# EAGLE board QCopter (EAGLE 7.1.0), part 1 of 2
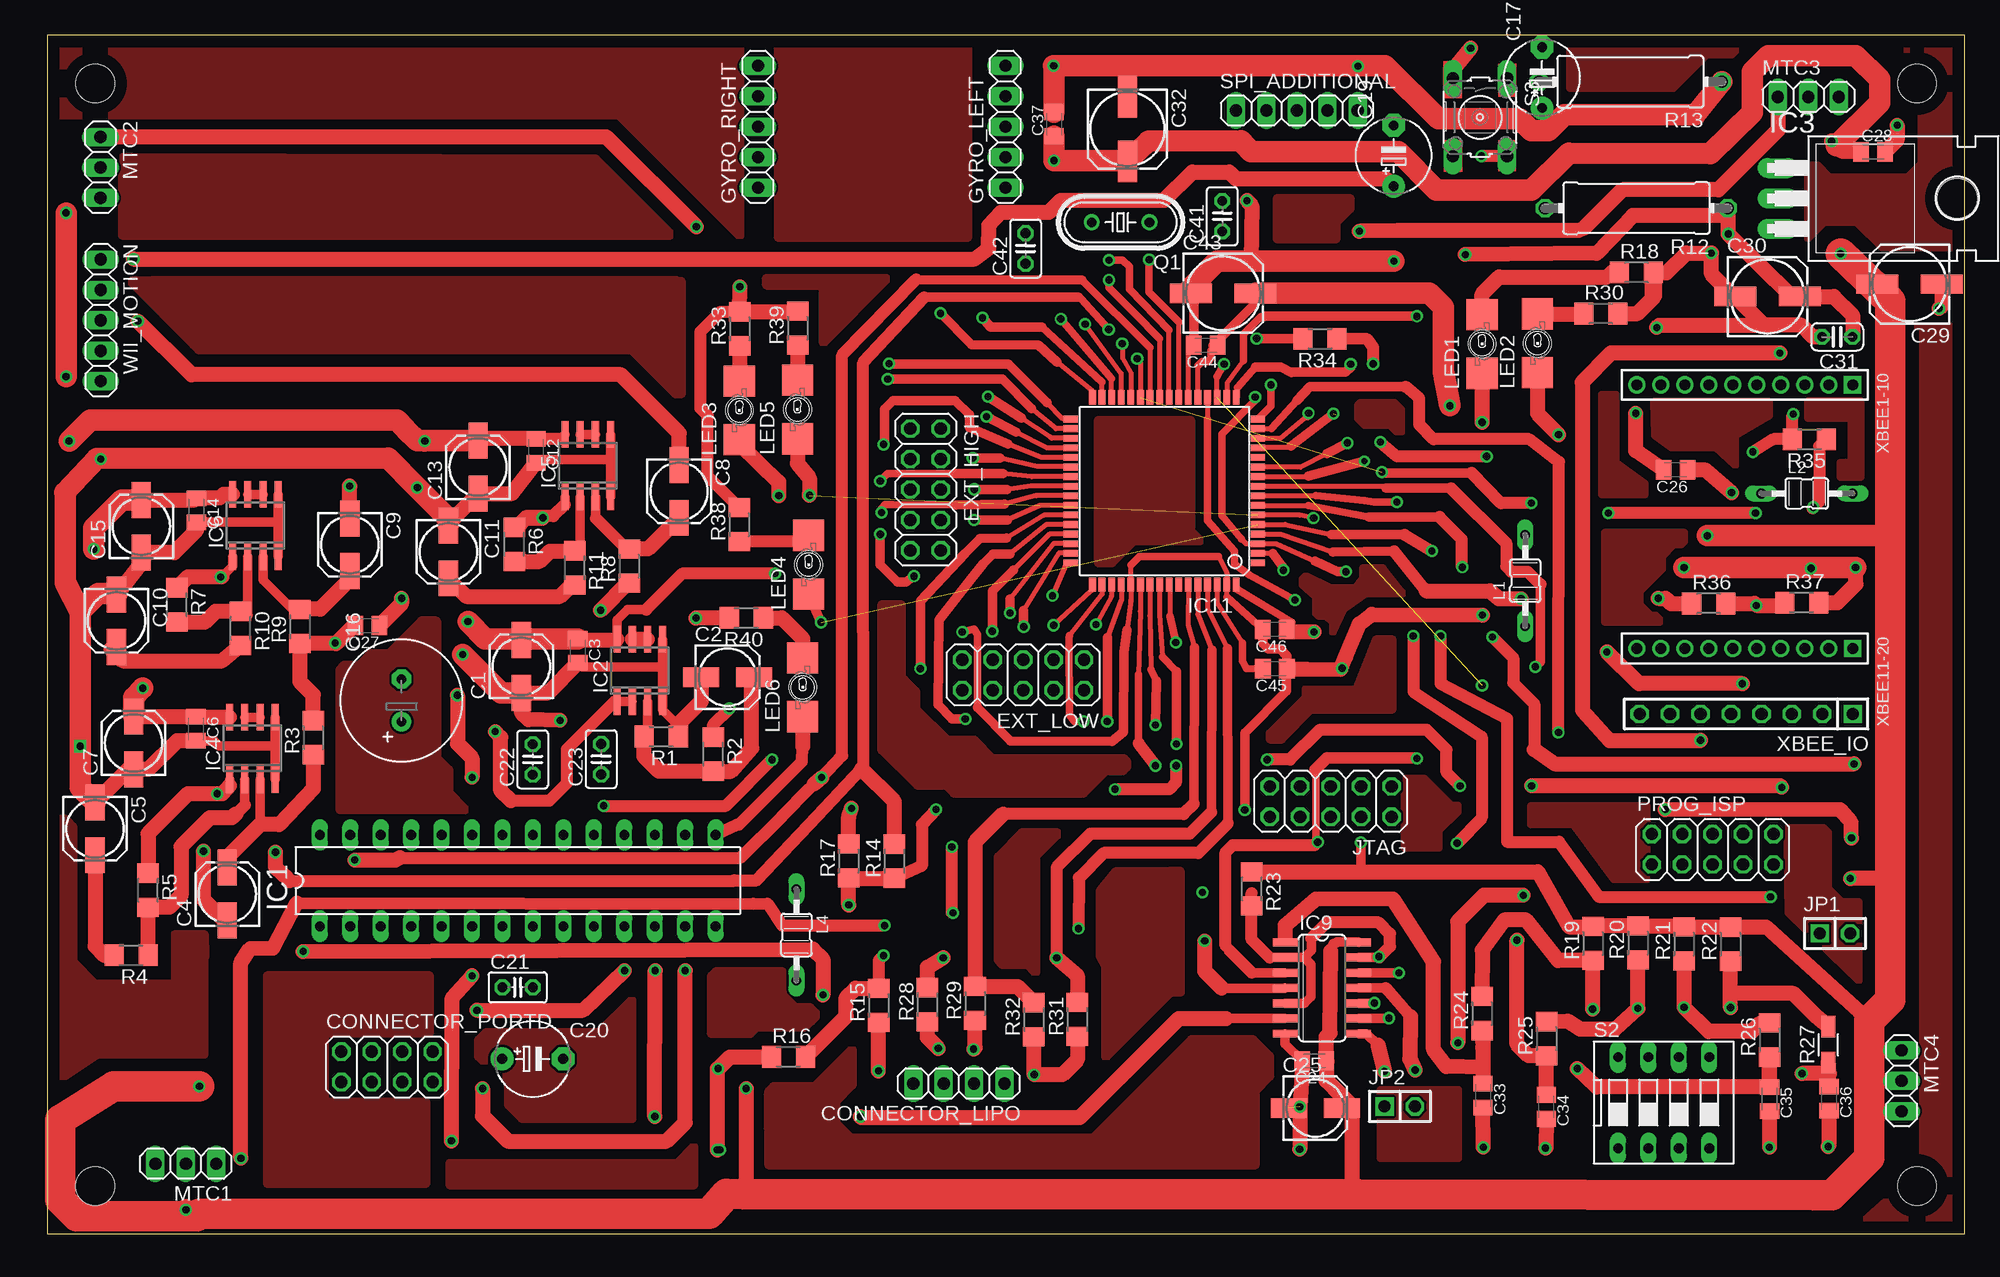
[diagram p1: board, top side]
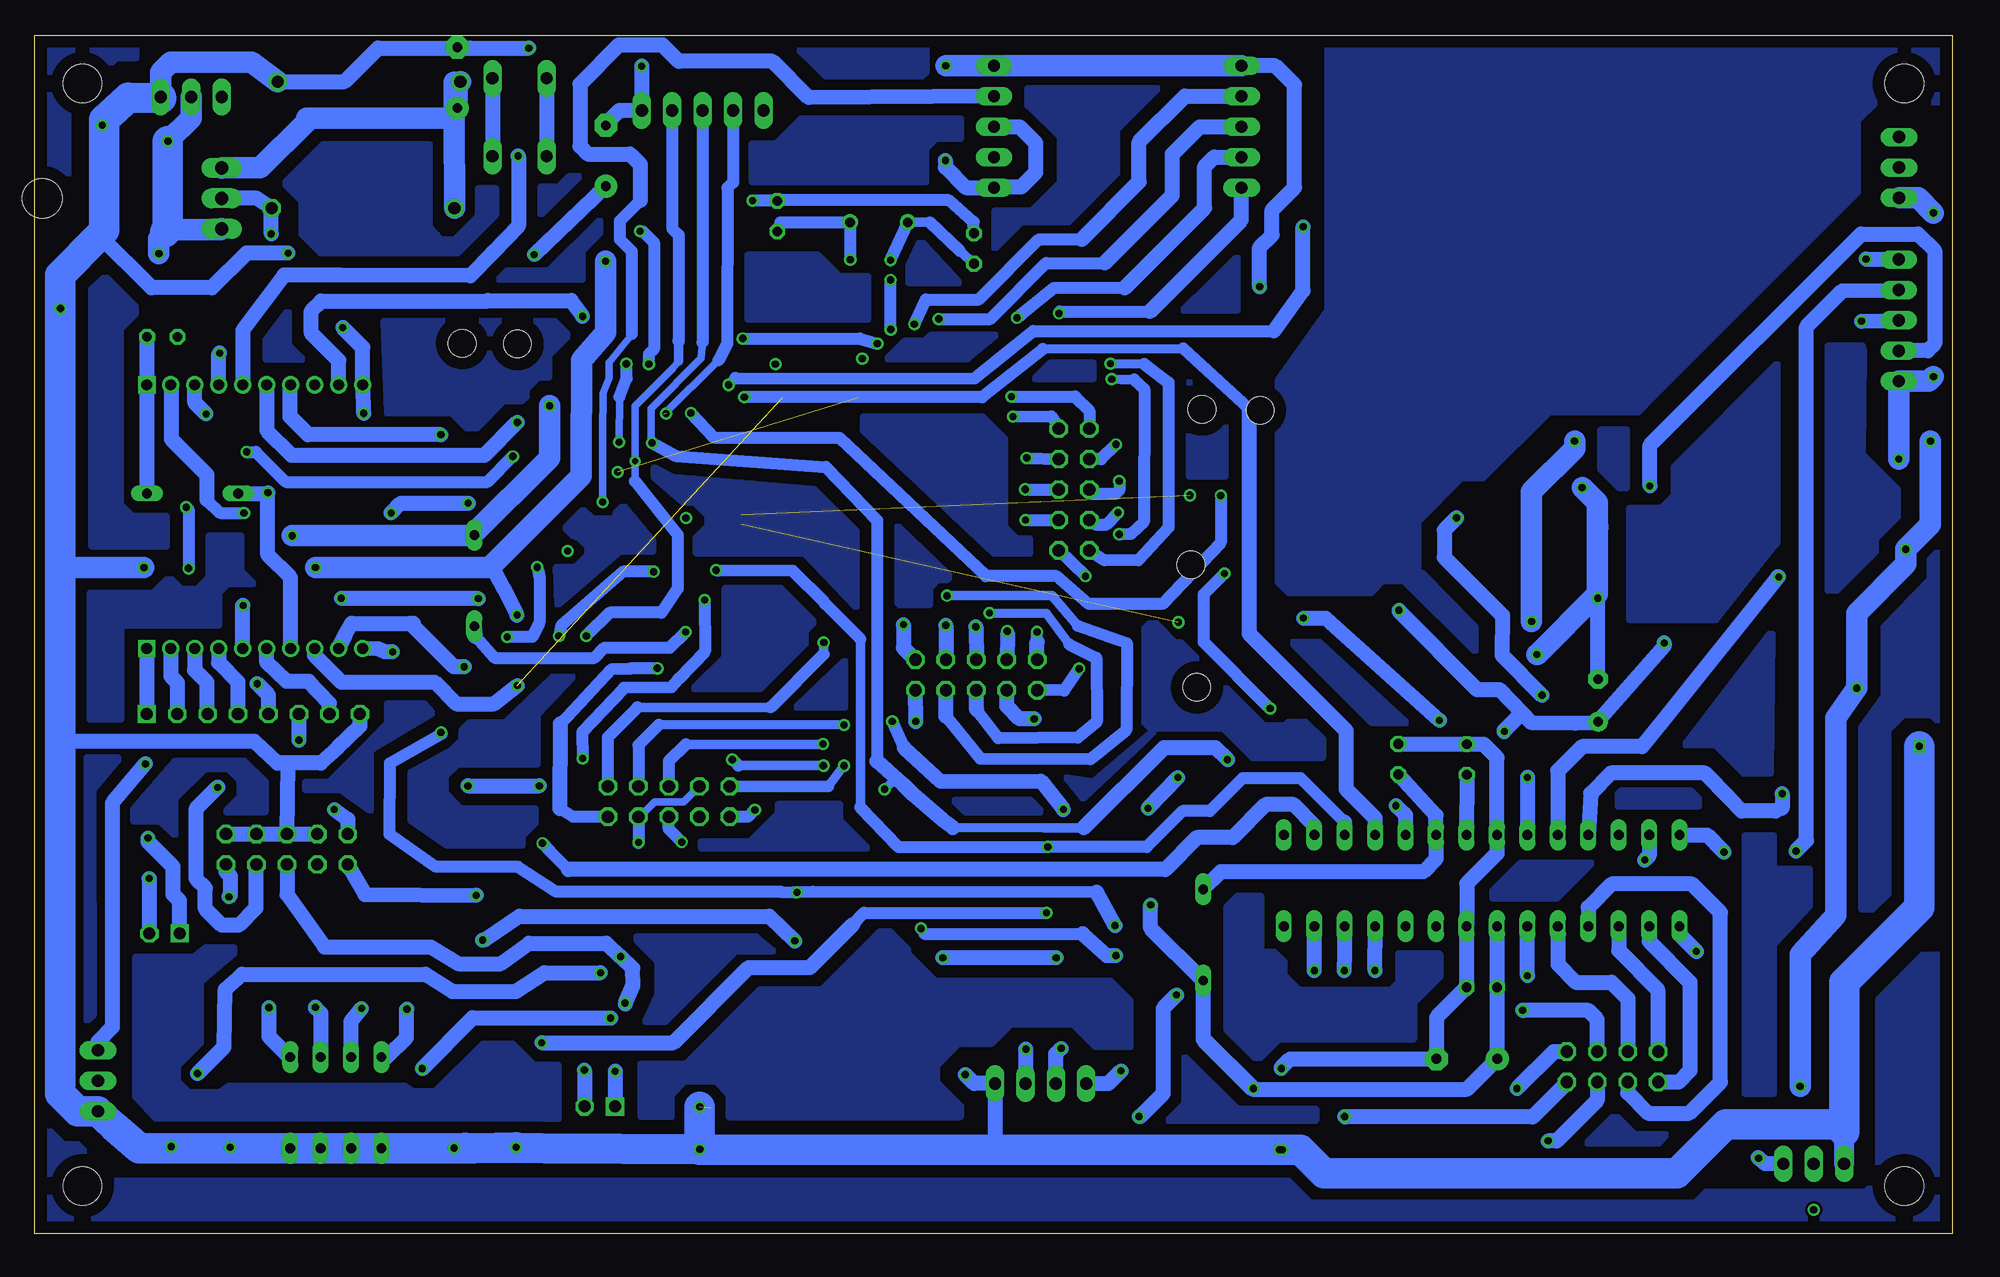
[diagram p2: board, bottom side, seen from below]

Size 160 x 100 mm. Coordinates in mm from the lower left corner, seen from the top.
Outline: 0,0 160,0 160,100 0,100 0,0
Copper layers (1*16): Top 0.035mm / dielectric 1.5mm / Bottom 0.035mm
Design rules "default": minimum track width 10mil, minimum drill 24mil, track to track 8mil, track to pad 8mil, pad to pad 8mil, via to via 8mil, smd to smd 8mil, copper to edge 40mil, drill to drill 8mil, minimum pad ring 10mil, minimum via ring 8mil, stop-mask expansion 4mil, vias tented up to drill 0mil, thermal gap 10mil
Holes 3.2 mm at 4,4 156,4 156,96 4,96

## Footprints (pad centres in the part's own frame; a part is rotated, then mirrored left to right if it is on the bottom)
153CLV-0505 = smd 3 x 1.6: + 2.2,0; - -2.2,0
C0805K = smd 1.3 x 1.6: 1 -1,0; 2 1,0
E3,5-10 = drill 0.813 pad 1.6: + -1.778,0 | drill 0.813 pad 1.6 octagon: - 1.778,0
E5-6 = drill 0.813 pad 1.905: + -2.54,0 | drill 0.813 pad 1.905 octagon: - 2.54,0
C025-025X050 = drill 0.813 octagon: 1 -1.27,0; 2 1.27,0
153CLV-0605 = smd 3.5 x 1.6: + 2.7,0; - -2.7,0
C025-024X044 = drill 0.813 octagon: 1 -1.27,0; 2 1.27,0
1X04 = drill 1.016 long: 1 -3.81,0; 2 -1.27,0; 3 1.27,0; 4 3.81,0
2X04 = drill 1.016 octagon: 1 -3.81,-1.27; 2 -3.81,1.27; 3 -1.27,-1.27; 4 -1.27,1.27; 5 1.27,-1.27; 6 1.27,1.27; 7 3.81,-1.27; 8 3.81,1.27
2X05 = drill 1.016 octagon: 1 -5.08,-1.27; 2 -5.08,1.27; 3 -2.54,-1.27; 4 -2.54,1.27; 5 0,-1.27; 6 0,1.27; 7 2.54,-1.27; 8 2.54,1.27; 9 5.08,-1.27; 10 5.08,1.27
1X05 = drill 1.016 long: 1 -5.08,0; 2 -2.54,0; 3 0,0; 4 2.54,0; 5 5.08,0
DIL28-3 = drill 0.813 long: 1 -16.51,-3.81; 2 -13.97,-3.81; 3 -11.43,-3.81; 4 -8.89,-3.81; 5 -6.35,-3.81; 6 -3.81,-3.81; 7 -1.27,-3.81; 8 1.27,-3.81; 9 3.81,-3.81; 10 6.35,-3.81; 11 8.89,-3.81; 12 11.43,-3.81; 13 13.97,-3.81; 14 16.51,-3.81; 15 16.51,3.81; 16 13.97,3.81; 17 11.43,3.81; 18 8.89,3.81; 19 6.35,3.81; 20 3.81,3.81; 21 1.27,3.81; 22 -1.27,3.81; 23 -3.81,3.81; 24 -6.35,3.81; 25 -8.89,3.81; 26 -11.43,3.81; 27 -13.97,3.81; 28 -16.51,3.81
SO08 = smd 0.6 x 2.2: 1 -1.905,-2.6; 2 -0.635,-2.6; 3 0.635,-2.6; 4 1.905,-2.6; 5 1.905,2.6; 6 0.635,2.6; 7 -0.635,2.6; 8 -1.905,2.6
TO220H = drill 1.118 long: 1 -2.54,-10.16; 2 0,-10.16; 3 2.54,-10.16 | hole 3.302: 0,4.826
SO14 = smd 0.66 x 2.032: 1 -3.81,-3.073; 2 -2.54,-3.073; 3 -1.27,-3.073; 4 0,-3.073; 5 1.27,-3.073; 6 2.54,-3.073; 7 3.81,-3.073; 8 3.81,3.073; 9 2.54,3.073; 10 1.27,3.073; 11 0,3.073; 12 -1.27,3.073; 13 -2.54,3.073; 14 -3.81,3.073
TQFP64 = smd 1.194 x 0.559: 1 -7.8,6; 2 -7.8,5.2; 3 -7.8,4.4; 4 -7.8,3.6; 5 -7.8,2.8; 6 -7.8,2; 7 -7.8,1.2; 8 -7.8,0.4; 9 -7.8,-0.4; 10 -7.8,-1.2; 11 -7.8,-2; 12 -7.8,-2.8; 13 -7.8,-3.6; 14 -7.8,-4.4; 15 -7.8,-5.2; 16 -7.8,-6; 33 7.8,-6; 34 7.8,-5.2; 35 7.8,-4.4; 36 7.8,-3.6; 37 7.8,-2.8; 38 7.8,-2; 39 7.8,-1.2; 40 7.8,-0.4; 41 7.8,0.4; 42 7.8,1.2; 43 7.8,2; 44 7.8,2.8; 45 7.8,3.6; 46 7.8,4.4; 47 7.8,5.2; 48 7.8,6 | smd 0.559 x 1.194: 17 -6,-7.8; 18 -5.2,-7.8; 19 -4.4,-7.8; 20 -3.6,-7.8; 21 -2.8,-7.8; 22 -2,-7.8; 23 -1.2,-7.8; 24 -0.4,-7.8; 25 0.4,-7.8; 26 1.2,-7.8; 27 2,-7.8; 28 2.8,-7.8; 29 3.6,-7.8; 30 4.4,-7.8; 31 5.2,-7.8; 32 6,-7.8; 49 6,7.8; 50 5.2,7.8; 51 4.4,7.8; 52 3.6,7.8; 53 2.8,7.8; 54 2,7.8; 55 1.2,7.8; 56 0.4,7.8; 57 -0.4,7.8; 58 -1.2,7.8; 59 -2,7.8; 60 -2.8,7.8; 61 -3.6,7.8; 62 -4.4,7.8; 63 -5.2,7.8; 64 -6,7.8
1X02 = drill 1.016 square: 1 -1.27,0 | drill 1.016 octagon: 2 1.27,0
MMICC7 = drill 0.813 long: 1 -3.81,0; 2 3.81,0
P47F-TOP = smd 2.6 x 2.6: A -2.45,0; C 2.45,0 | hole 2.3: 0,0
1X03 = drill 1.016 long: 1 -2.54,0; 2 0,0; 3 2.54,0
HC49/S = drill 0.813: 1 -2.413,0; 2 2.413,0
R1206 = smd 1.6 x 1.803: 1 -1.422,0; 2 1.422,0
0414/15 = drill 1.016 octagon: 1 -7.62,0; 2 7.62,0
R1206W = smd 1.8 x 1.2: 1 -1.499,0; 2 1.499,0
DS-04 = drill 0.813 long: 1 -3.81,-3.81; 2 -1.27,-3.81; 3 1.27,-3.81; 4 3.81,-3.81; 5 3.81,3.81; 6 1.27,3.81; 7 -1.27,3.81; 8 -3.81,3.81
B3F-10XX = drill 1.016 long: 1 -3.251,2.261; 2 3.251,2.261; 3 -3.251,-2.261; 4 3.251,-2.261
1X10M = drill 0.914 square: 1 -9,0 | drill 0.914: 2 -7,0; 3 -5,0; 4 -3,0; 5 -1,0; 6 1,0; 7 3,0; 8 5,0; 9 7,0; 10 9,0
1X08 = drill 1.016 square: 1 -8.89,0 | drill 1.016 octagon: 2 -6.35,0; 3 -3.81,0; 4 -1.27,0; 5 1.27,0; 6 3.81,0; 7 6.35,0; 8 8.89,0

## Placement (x,y rotation side)
C1  100u  [153CLV-0505]  39.55,47.35 90 top
C2  10u  [153CLV-0505]  56.76,46.45 0 top
C3  100n  [C0805K]  44.27,48.64 270 top
C4  10u  [153CLV-0505]  15.02,28.36 90 top
C5  100u  [153CLV-0505]  3.98,33.8 270 top
C6  100n  [C0805K]  12.41,42.13 270 top
C7  22u  [153CLV-0505]  7.21,40.96 90 top
C8  10u  [153CLV-0505]  52.71,61.95 270 top
C9  10u  [153CLV-0505]  25.25,57.51 270 top
C10  100u  [153CLV-0505]  5.78,51.16 270 top
C11  100u  [153CLV-0505]  33.46,56.9 270 top
C12  100n  [C0805K]  40.78,65.34 270 top
C13  22u  [153CLV-0505]  35.94,63.98 90 top
C14  100n  [C0805K]  12.44,60.39 270 top
C15  22u  [153CLV-0505]  7.85,59.05 90 top
C16  1000u  [E3,5-10]  29.55,44.51 90 top
C17  10u  [E5-6]  124.72,96.48 90 top
C19  1u  [E5-6]  112.34,89.96 90 top
C20  100u  [E5-6]  40.5,14.6 0 top
C21  100n  [C025-025X050]  39.24,20.57 0 top
C22  100n  [C025-025X050]  40.5,39.58 90 top
C23  100n  [C025-025X050]  46.22,39.61 90 top
C24  100n  [C0805K]  105.72,14.43 180 top
C25  10u  [153CLV-0505]  105.8,10.49 0 top
C26  100n  [C0805K]  135.86,63.75 180 top
C27  100n  [C0805K]  26.72,50.75 180 top
C28  100n  [C0805K]  152.34,90.28 0 top
C29  100u  [153CLV-0605]  155.38,79.25 180 top
C30  1u  [153CLV-0605]  143.53,78.22 0 top
C31  8.2p  [C025-024X044]  149.34,74.84 180 top
C32  1u  [153CLV-0605]  90.12,92.19 270 top
C33  10n  [C0805K]  119.78,11.54 270 top
C34  10n  [C0805K]  125.07,10.6 270 top
C35  10n  [C0805K]  143.69,11.25 270 top
C36  10n  [C0805K]  148.66,11.28 270 top
C37  100n  [C0805K]  84,92.59 90 top
C41  22p  [C025-025X050]  98.03,84.92 90 top
C42  22p  [C025-025X050]  81.63,82.22 90 top
C43  100u  [153CLV-0605]  98.11,78.48 0 top
C44  100n  [C0805K]  96.66,74.15 180 top
C45  100n  [C0805K]  102.43,47.15 180 top
C46  100n  [C0805K]  102.41,50.43 180 top
CONNECTOR_LIPO  [1X04]  76.06,12.54 180 top
CONNECTOR_PORTD  [2X04]  28.34,13.93 0 top
EXT_HIGH  [2X05]  73.28,62.11 270 top
EXT_LOW  [2X05]  81.42,46.63 180 top
GYRO_LEFT  [1X05]  79.95,92.38 90 top
GYRO_RIGHT  [1X05]  59.29,92.38 90 top
IC1  MEGA8-P  [DIL28-3]  39.25,29.47 0 top
IC2  LM358D  [SO08]  49.44,47.01 0 top
IC3  317T  [TO220H]  154.54,86.4 270 top
IC4  LM358D  [SO08]  17.11,40.51 0 top
IC5  LM358D  [SO08]  45.1,64.1 0 top
IC6  LM358D  [SO08]  17.37,59.1 0 top
IC9  74LS32D  [SO14]  106.35,20.52 270 top
IC11  MEGA64-A  [TQFP64]  93.2,61.99 180 top
JP1  [1X02]  149.15,25.06 0 top
JP2  [1X02]  112.84,10.62 0 top
JTAG  [2X05]  107.08,36.07 180 top
L1  MMICC7  [MMICC7]  123.31,54.5 90 top
L2  MMICC7  [MMICC7]  146.81,61.78 0 top
L4  MMICC7  [MMICC7]  62.5,24.94 270 top
LED1  LAP4-TOP  [P47F-TOP]  119.71,74.25 90 top
LED2  LAP4-TOP  [P47F-TOP]  124.33,74.31 90 top
LED3  LAP4-TOP  [P47F-TOP]  57.74,68.72 90 top
LED4  LAP4-TOP  [P47F-TOP]  63.52,55.84 90 top
LED5  LAP4-TOP  [P47F-TOP]  62.59,68.79 90 top
LED6  LAP4-TOP  [P47F-TOP]  63.03,45.6 90 top
MTC1  [1X03]  11.56,5.85 180 top
MTC2  [1X03]  4.43,88.98 270 top
MTC3  [1X03]  146.94,94.87 0 top
MTC4  [1X03]  154.72,12.76 270 top
PROG_ISP  [2X05]  138.95,32.09 0 top
Q1  8MHz  [HC49/S]  89.55,84.41 180 top
R1  10k  [R1206]  51.22,41.5 180 top
R2  10k  [R1206]  55.56,40.02 270 top
R3  22k  [R1206]  22.19,41.4 90 top
R4  2k  [R1206]  6.99,23.25 180 top
R5  50k  [R1206]  8.4,28.67 270 top
R6  50k  [R1206]  38.97,57.53 270 top
R7  50k  [R1206]  10.81,52.48 270 top
R8  22k  [R1206]  48.56,55.73 90 top
R9  22k  [R1206]  21.09,50.68 90 top
R10  2k  [R1206]  16.13,50.52 270 top
R11  2k  [R1206]  44.01,55.57 270 top
R12  470  [0414/15]  132.59,85.58 180 top
R13  1240  [0414/15]  132.09,96.15 180 top
R14  10k  [R1206]  70.68,31.1 90 top
R15  20k  [R1206]  69.36,19.06 90 top
R16  10k  [R1206]  61.85,14.77 0 top
R17  10k  [R1206]  66.87,31.11 90 top
R18  470  [R1206]  132.59,80.22 0 top
R19  20k  [R1206]  128.96,24.23 90 top
R20  20k  [R1206]  132.71,24.28 90 top
R21  20k  [R1206]  136.56,24.2 90 top
R22  20k  [R1206]  140.43,24.17 90 top
R23  10k  [R1206]  100.5,28.79 270 top
R24  20k  [R1206]  119.71,18.38 90 top
R25  20k  [R1206]  125.09,16.28 90 top
R26  20k  [R1206]  143.68,16.18 90 top
R27  20k  [R1206W]  148.59,15.79 90 top
R28  20k  [R1206]  73.44,19.12 90 top
R29  20k  [R1206]  77.41,19.22 90 top
R30  470  [R1206]  129.63,76.79 0 top
R31  10k  [R1206]  85.94,17.89 90 top
R32  10k  [R1206]  82.31,17.87 90 top
R33  1k  [R1206]  57.78,75.52 90 top
R34  10k  [R1206]  106.19,74.68 180 top
R35  20k  [R1206]  147.02,66.31 180 top
R36  10k  [R1206]  138.62,52.6 0 top
R37  20k  [R1206]  146.38,52.67 0 top
R38  1k  [R1206]  57.74,59.18 90 top
R39  1k  [R1206]  62.61,75.57 90 top
R40  1k  [R1206]  58.32,51.4 180 top
S2  [DS-04]  134.86,10.94 0 top
S3  [B3F-10XX]  119.54,93.17 270 top
SPI_ADDITIONAL  [1X05]  104.26,93.74 0 top
WII_MOTION  [1X05]  4.47,76.23 270 top
XBEE1-10  [1X10M]  141.62,70.84 180 top
XBEE11-20  [1X10M]  141.64,48.84 180 top
XBEE_IO  [1X08]  141.75,43.38 180 top

## Tracks (layer width: path | path; a pad name or v marks a point on that pad's centre or on a via)
ADC1  (via drill 0.6)
  Top 0.813: IC5.1 43.2,60.85 | 39.89,59.88 R6.1
  Top 1.016: 43.2,60.85 42.22,59.88 39.89,59.88
  Top 1.27: R6.1 39.2,58.95 39.97,59.72 41.31,59.72 v41.34,59.75 | v34.22,44.94 34.22,40.91 35.44,39.69 v35.44,38.09
  Bottom 1.27: v41.34,59.75 42.38,58.72 42.38,56.44 37.56,51.62 37.53,51.62 37.56,48.28 v34.22,44.94 | v35.44,38.09 IC1.23
ADC2  (via drill 0.6)
  Top 0.813: IC6.1 15.46,55.71 14.56,54.81
  Top 1.27: R7.1 11.72,54.81 v14.47,54.81 14.56,54.81
  Bottom 1.27: v14.47,54.81 14.56,54.81 24.09,42.88 25.88,40.66 30.88,40.66 32.91,38.62 IC1.24
ADC3  (via drill 0.6)
  Top 0.813: IC4.1 15.21,37.4 14.53,36.72
  Top 1.27: 14.53,36.72 11.72,36.72 8.41,33.41 R5.1 | 15.21,37.4 14.59,36.72 v14.19,36.72
  Bottom 1.27: v14.19,36.72 14.19,35.53 14.72,35.28 17.56,35.28 18.56,36.34 20.62,38.44 28.5,38.44 30.16,36.75 IC1.25
BMA_INT  (via drill 0.6)
  Top 0.406: IC11.8 105.84,61.59
  Top 0.61: 105.84,61.59 109.88,61.19 110.69,61.06 v112.59,61.06
  Bottom 0.61: v112.59,61.06 112.59,66.78 112.56,70.16 112.06,71.41 112.06,72.72 110.16,75.09
  Bottom 1.016: 110.16,75.09 110.16,81.97 111.16,82.97 111.16,84.53 109.47,86.22
  Bottom 1.27: GYRO_LEFT.4 95.38,94.81 95.41,94.81 98.44,97.84 106.25,97.84 107.59,99.19 111.25,99.19 114.5,95.94 114.5,90.75 113.84,90.09 110.31,90.09 109.47,89.25 109.47,86.22
BMA_MISO  (via drill 0.6)
  Top 0.406: IC11.29 89.6,71.77 89.59,71.78 v86.59,75.91
  Bottom 1.016: v86.59,75.91 85.62,77.97 81.22,77.97 76.19,83 72.62,83 | 59.31,94.94 GYRO_RIGHT.4
  Bottom 1.27: 72.62,83 67.84,87.78 67.84,91.12 64.03,94.94 59.31,94.94
BMA_MOSI  (via drill 0.6)
  Top 0.406: IC11.30 88.8,71.38
  Top 0.61: 88.8,71.38 v84.56,76.34
  Bottom 1.016: v84.56,76.34 80.25,76.34 75.59,81 70.72,81 | GYRO_RIGHT.3
  Bottom 1.27: 70.72,81 65.06,86.66 65.06,90.09 62.78,92.38 GYRO_RIGHT.3
BMA_SCK  (via drill 0.6)
  Top 0.406: IC11.31 88,71.06
  Top 0.61: 88,71.06 83,75.66
  Top 0.813: 83,75.66 78.69,75.66 v78.03,76.44
  Bottom 1.016: 69.03,78.94 74.91,78.94 77.72,76.66 v78.03,76.44 | GYRO_RIGHT.2
  Bottom 1.27: 69.03,78.94 62.38,85.59 62.38,89.06 61.59,89.84 GYRO_RIGHT.2
BMA_SS  (via drill 0.6)
  Top 0.406: IC11.32 87.19,70.31 84.25,72.75
  Top 0.813: 84.25,72.75 82.69,74.16 77.09,74.19 v74.53,76.81
  Bottom 0.813: v74.53,76.81 74.47,76.97
  Bottom 1.016: 74.47,76.97 66.94,76.97 | 59.31,87.28 GYRO_RIGHT.1
  Bottom 1.27: 66.94,76.97 59.31,84.59 59.31,87.28
EXT_LOW  (via drill 0.6)
  Top 0.406: IC11.51 88.78,53.19 v87.5,50.84
  Bottom 1.27: v87.5,50.84 87.5,48.9 EXT_LOW.1
EXTMEM_LATCH_EN  (via drill 0.6)
  Top 0.406: IC11.43 83.16,59.97 80.03,58.06
  Top 0.813: 80.03,58.06 77.81,58.03 76.56,56.78 72.84,52.81 v72.84,47.16
  Bottom 1.016: v72.84,47.16 74.11,45.33 EXT_LOW.10
EXTMEM_RD  (via drill 0.6)
  Top 0.406: IC11.34 84.16,67.19 82.12,68.88
  Top 0.813: 82.12,68.88 79.69,71.31 v70.12,71.31 | v69.5,58.38 69.5,55.84 70.94,54.41 71.66,54.41 v72.31,54.88
  Bottom 0.813: v70.12,71.31 69.31,71.28 68.25,71.28 | 69.47,58.34 v69.5,58.38 | 74.53,57.02 EXT_HIGH.10
  Bottom 1.016: 68.25,71.28 67.41,70.5 67.44,59.41 68.5,58.41 69.47,58.34 | v72.31,54.88 74.53,57.02
EXTMEM_WR  (via drill 0.6)
  Top 0.406: IC11.33 84.76,67.99 83.41,69.34
  Top 0.813: 83.41,69.34 83.41,69.38 80.19,72.59 70.25,72.59 v70.22,72.62
  Bottom 0.813: v70.22,72.62 67.41,72.59
  Bottom 1.016: 67.41,72.59 65.38,71.03 65.38,58.94 67.91,56.22 70.72,56.19 EXT_HIGH.9
GND  (via drill 0.6)  (1 unrouted)
  Top 0.406: IC11.22 95.2,74.11 C44.2 | 90.09,50.38 90.41,52.88 90.4,52.88 IC11.53 90.4,55.81 | 97.72,56.53 97.75,56.53 98.41,55.16 IC11.63 98.4,53.13 98.41,53.12
  Top 0.61: 77.59,43.97 77.62,44 77.59,50 77.31,50.47 v76.34,50.22 | 90.4,55.81 91.12,56.53 97.72,56.53 | 98.41,53.12 C46.2
  Top 0.813: IC5.4 47.01,64.59 | 47.01,64.59 IC5.5 | C12.2 40.78,64.59 47.01,64.59 | C14.2 19.27,59.39 | 19.27,59.39 IC6.5 | IC6.4 19.27,59.39 | C6.2 13.93,41.13 14.34,40.72 19,40.72 | 19,40.72 19,43.09 IC4.5 | IC4.4 19.02,40.7 19,40.72 | IC2.5 IC2.4 | IC2.4 51.35,47.28 44.62,47.28 C3.2 | IC2.4 51.35,43.72 52.59,42.47 52.69,41.14 R1.1 | C44.2 95.66,78.29 C43.- | 90.09,50.38 89.81,48.56 89.78,41.88 88.81,41.09 80.38,41.12 77.59,43.91 77.59,43.97 | C46.2 101.41,49.24 101.88,48.78 102.88,48.78 103.44,48.22 103.44,47.16 C45.1 103.41,47.13 103.41,45.31 99.91,41.81 v99.91,35.38 | IC9.7 103.28,15.87 C24.2 | 108.33,48.12 108.33,47.58 v108.03,47.19
  Top 1.016: R35.1 147.84,65.71 147.84,61.09 147.28,60.53 v147.34,60.62 | v147.16,55.53 146.28,55.59 146.06,55.44 | R38.2 55.09,63.25 55.09,68.28 54.5,68.88 54.5,75.28 56.16,76.94 R33.2
  Top 1.27: v119.81,7.22 v119.81,7.23 C33.2 | C34.2 125.03,7.18 v125,7.16 | C35.2 143.69,7.66 v143.69,7.22 | C36.2 148.66,7.47 v148.59,7.28 | C24.2 104.72,14.12 v104.5,10.59 v104.5,7.06 | v55.91,7 55.91,13.78 v55.97,13.78 56.95,14.77 R16.1 | C12.2 38.79,61.78 C13.- 33.59,59.3 C11.- | C10.- 7.85,55.96 C15.- 10.59,56.84 12.44,58.69 C14.2 | C6.2 10.82,41.13 8.44,38.75 C7.- | C7.- | C7.- 6.74,38.75 C5.- | C3.2 41.77,45.15 C1.- 39.59,45.1 39.59,43.44 40.12,42.91 v42.78,42.84 | C2.- 54.56,44.43 52.59,42.47 | v29.56,53.03 29.56,52.59 C27.1 | 4.12,64.69 4.44,64.69 v4.47,64.66 | v154.34,92.5 154.34,91.28 C28.2 | R40.2 54.15,51.4 v54.12,51.38 | R32.1 82.34,16.41 v82.34,13.28 84.69,13.28 85.94,14.53 R31.1 | C31.2 147.34,74.84 146.38,75.81 143.24,75.81 | 143.24,75.81 C30.- 140.72,78.22 138.84,80.09 v138.84,81.84 136.75,81.84 135.09,80.19 134.12,80.19 133.94,80 133.94,78.03 132.69,76.79 132.66,76.79 | v134.28,75.62 134.47,75.81 143.24,75.81 | C26.2 132.53,65.34 v132.53,68.47 | C32.- 90.12,96.97 89.62,97.47 | 111.62,97.47 109.38,97.47 v109.34,97.44 | R30.2 132.66,76.79 | 132.66,76.79 134.12,78.25 134.12,80.11 R18.2 | C29.- 158.07,77.45 v157.84,77.22 | v100.09,86.22 100.5,85.78 100.44,81.16 | R37.2 149.35,52.67 150.91,54.22 150.91,55.56 v150.88,55.59 | C45.1 105.09,47.12 107.91,47.09 108.33,48.12 109.47,50.91 110.5,51.69 v119.75,51.62 | v57.78,79.03 R33.2 62.56,76.94 R39.2 | v118.75,98.94 117.22,97.09 117.28,95.91 | 117.28,95.91 117.28,95.41 | 117.28,95.91 S3.3
  Top 1.778: 2.75,51.94 v2.75,40.69 2.75,37.23 C5.- | 2.75,51.94 4.25,53.44 5.29,53.44 C10.- | 2.75,51.94 1.5,54.34 1.5,61.88 1.47,61.88 4.12,64.69 28.44,64.72 v30.88,62.28 33.46,59.69 C11.- | C1.- 37.85,45.15 v34.66,48.34 | v1.56,71.53 v1.56,85.19 | R13.1 137.5,93.38 126.56,93.38 125.25,92.06 123.81,92.06 122.84,93.03 116.06,93.03 111.62,97.47 89.62,97.47 v83.97,97.47 84,97.44 C37.2 | C43.- 95.41,78.97 97.59,81.16 100.44,81.16 v112.34,81.16 | v136.56,55.59 146.28,55.59 v150.88,55.59
  Bottom 0.61: 76.34,49.41 76.38,49.44
  Bottom 0.813: 98.12,86.25 C41.2 | 76.34,49.41 76.34,50.37 76.31,50.09 | 110.41,47.16 110.31,47.16
  Bottom 1.016: 98.09,86.22 v100.09,86.22 | C42.2 81.65,84.43 83.72,86.25 98.12,86.25 | v147.34,60.62 147.16,60.44 v147.16,55.53 | 76.38,49.44 v76.34,50.22 | v99.91,35.38 100.48,34.8 JTAG.10 | JTAG.2 115.08,34.8 116.16,35.47 | 116.12,42.56 111.84,47.12 110.41,47.16 | v108.03,47.19 110.31,47.16
  Bottom 1.27: v125,7.16 126.16,7.2 126.22,7.13 | v143.69,7.22 143.78,7.12 | v148.59,7.28 147.59,6.84 147.44,7.12 | C23.2 40.52,40.88 C22.2 40.49,40.84 39.09,40.84 37.98,39.73 IC1.22 37.98,31.74 40.5,29.22 40.5,25.68 IC1.8 C21.2 43.04,18.05 C20.- 55.25,14.59 55.97,13.88 v55.97,13.78 | 29.59,53.38 29.59,53.06 v29.56,53.03 29.55,53.02 C16.- | WII_MOTION.5 | 154.19,92.97 154.34,92.81 v154.34,92.5 | v54.12,51.38 52.28,51.38 v42.78,42.84 | 79.62,7 79.87,7.25 CONNECTOR_LIPO.1 81.6,12.54 v82.34,13.28 | R13.1 134.13,96.15 131.34,98.94 123.66,98.94 | 123.66,98.94 v118.75,98.94 | S3.3 | S3.3 S3.4 | v138.84,81.84 142.31,81.84 145.22,78.94 150.24,78.94 154.62,83.31 | v134.28,75.62 132.62,73.97 XBEE1-10.10 132.59,70.81 v132.53,68.47 | XBEE_IO.8 132.86,42.35 134.75,40.53 134.72,40.56 136.12,39.28 139.75,39.28 | 139.75,39.28 141.66,41.09 157.84,41.09 | v109.34,97.44 SPI_ADDITIONAL.5 111.19,93.75 112.34,92.6 C19.- | C17.- 123.66,98.94 | C41.2 98.09,86.22 | EXT_LOW.9 76.34,49.41 | v119.75,51.62 120.88,53.88 121.84,55.78 | 116.16,35.47 116.12,42.56 | 139.75,39.28 138.89,39.27 PROG_ISP.6 | PROG_ISP.6 PROG_ISP.8 PROG_ISP.10 | PROG_ISP.6 PROG_ISP.4 | v57.78,79.03 57.78,82.31 56.75,83.34 56.75,85.44 54.88,87.31 54.88,95.88 56.47,97.47 GYRO_RIGHT.5
  Bottom 1.676: MTC1.3 9.02,8.52
  Bottom 1.778: v34.66,48.34 34.62,48.34 29.59,53.38 29.59,58.94 | v30.88,62.28 29.59,61 29.59,58.94 | 29.59,58.94 29.56,58.94 29.56,59 | v4.47,64.66 WII_MOTION.5 | WII_MOTION.5 1.95,71.15 v1.56,71.53 | v1.56,85.19 2.82,86.44 MTC2.3 | R13.1 141.87,97.75 148.66,97.75 149.48,96.93 MTC3.3 | GYRO_RIGHT.5 GYRO_LEFT.5 v83.97,97.46 v83.97,97.47 | v112.34,81.16 112.34,75.19 114.34,72.91 114.38,69.19 114.41,67.75 114.41,63.22 121.84,55.78 122.03,55.59 v136.56,55.59 | v150.88,55.59 157.84,55.59
  Bottom 2.54: 124.31,7.13 126.22,7.13 S2.1 S2.2 S2.3 S2.4 138.07,7.12 143.78,7.12 147.44,7.12 151.25,7.12 153.44,9 MTC4.3 156.38,10.22 157.84,11.69 157.84,41.09 157.84,55.59 v157.84,77.22 157.84,80 154.62,83.31 154.19,83.75 154.19,92.97 152.19,94.81 149.41,94.78 MTC3.3 | 124.31,7.13 123.38,7.13 v119.81,7.22 | v104.5,7.06 124.08,7.16 124.31,7.13 | v104.5,10.59 104.5,7 79.62,7 v56.12,7 v55.91,7 54.38,7 52.44,5.06 22.97,5.06 18.91,9.12 9.62,9.12 9.02,8.52 9.02,20.98 2.75,27.25 v2.75,40.69
MISO  (via drill 0.6)
  Top 0.406: 105.78,56.12 102.53,57.59 101.44,57.59 101.43,57.59 IC11.3 100.01,57.59 99.62,57.97
  Top 0.61: v100.78,69.81 100.78,69.53 98,66.75 98,59.94 99.62,57.97
  Top 0.813: 105.78,56.12 107.62,55.25 v108.34,55.25
  Top 1.016: v116.25,49.88 116.25,45.91 121.78,43 121.78,32.72 126.12,32.72 129.44,28.12 v143.78,28.12
  Bottom 0.813: 64.16,73.88 75.88,73.84
  Bottom 1.016: 58.66,68.81 64.16,73.88 | 75.88,73.84 80.94,69.81 v100.78,69.81 | v108.34,55.25 110.91,55.25 116.06,50.75 v116.25,49.88
  Bottom 1.27: IC1.18 48.14,34.67 50.56,37.09 50.56,41.97 58.66,50.06 58.66,68.81 | v143.78,28.12 143.66,28.25 143.66,29.84 144.03,30.22 PROG_ISP.9
MISO_A  (via drill 0.6)  (1 unrouted)
  Top 0.406: 103.78,65.72 103.66,65.59 IC11.13
  Top 0.813: v107.31,68.44 103.78,65.72
  Bottom 0.61: 102.94,72.91 107.5,68.34
  Bottom 1.016: SPI_ADDITIONAL.2 101.72,87.75 102.19,87.28 102.22,74.28 102.94,72.91
MOSI  (via drill 0.6)
  Top 0.406: IC11.2 102.24,56.79 102.25,56.78
  Top 0.61: 103.06,55.69 v103.12,55.38
  Top 0.813: 102.25,56.78 103.06,55.69
  Top 1.016: v75.56,26.78 75.47,26.81 v75.47,32.28
  Top 1.27: v123.16,28.25 119.84,28.25 117.69,26.06 v117.69,15.94
  Bottom 0.813: 91.09,35.59 91.09,49.62 | 94.06,52.59 94.06,52.62 | 103,55.34 v103.12,55.38
  Bottom 1.016: 50.68,34.34 54.34,38 59.22,38 61.94,35.28 64.22,35.28 67.22,32.28 v75.47,32.28 87.91,32.28 91.09,35.59 | 91.09,49.62 94.06,52.59 | 94.06,52.62 96.75,55.31 103,55.34 | 91.75,25.78 90.78,26.78 v75.56,26.78
  Bottom 1.27: IC1.17 50.68,34.34 | PROG_ISP.1 132.43,28.31 v123.16,28.25 | v117.69,15.94 106.69,15.94 100.41,22.22 95.31,22.22 91.75,25.78
N$1
  Top 0.813: IC2.3 50.08,41.93 R1.2
  Top 1.27: R1.2 49.78,41.48 49.78,39.84 51.03,38.6 R2.2 57.04,38.6 58.78,40.53 58.75,46.28 C2.+
N$2
  Top 1.27: IC2.6 IC2.7
N$3
  Top 0.813: IC4.7 IC4.6
N$4
  Top 0.813: 17.75,34.16 IC4.3
  Top 1.27: C4.+ 15.02,31.42 17.75,34.16 19.34,34.16 22.19,37.16 R3.1
N$5  (via drill 0.6)
  Top 0.406: IC11.15 102.16,67.19
  Top 0.61: 102.16,67.19 104.28,69.53
  Top 0.813: 104.28,69.53 105.34,70.69 113.34,70.69
  Top 1.016: 20.81,27.59 58.91,27.53 60.09,27.56 61.31,25.72 v69.84,25.72 | v126.09,41.84 126.12,64.41 123.66,66.31 115.66,66.31 114.47,67.53 114.47,69.72 113.34,70.69
  Top 1.27: v16.16,6.31 16.16,22.62 16.94,23.81 18.84,23.84 20.81,27.59
  Bottom 1.016: 71.38,28.5 95.06,28.53 v96.38,28.5 96.66,28.5 97.75,28.53 116.47,28.53 119.69,30.62 126.53,30.62 130.38,33.34 130.34,39.28 126,41.75 v126.09,41.84
  Bottom 1.27: MTC1.1 15.63,5.85 16.22,6.38 v16.16,6.31 | v69.84,25.72 71.38,28.5
N$6  (via drill 0.6)
  Top 0.406: IC11.16 101.33,67.99
  Top 0.61: IC11.16 102.09,69.08 v102.09,70.84
  Top 1.27: v54.16,84.03 46.66,91.52 MTC2.1
  Bottom 0.813: v102.09,70.84 101.53,71.41
  Bottom 1.016: 101.53,71.41 81.56,71.38 76.66,75.34 56.59,75.34
  Bottom 1.27: 56.59,75.34 54.16,78.69 v54.16,84.03
N$7
  Top 1.27: C5.+ 3.98,23.99 4.72,23.25 R4.2
N$8
  Top 0.813: IC4.2 16.48,35.76
  Top 1.016: 16.48,35.76 15.75,35.03
  Top 1.27: R4.1 8.42,27.23 R5.2 10.19,27.25 11.16,28.22 11.16,32.31 13.56,34.72 15.41,34.72 15.72,35.03 15.75,35.03
N$9
  Top 0.813: IC5.2 44.47,57.46 R11.1
  Top 1.27: R6.2 41.08,56.11 41.94,56.97 43.98,56.97 R11.1
N$10
  Bottom 1.27: IC1.2 25.28,24.41 21.88,21 21.88,13.62 22.84,12.66 CONNECTOR_PORTD.1
N$11
  Top 0.813: IC6.2 16.73,51.67 16.75,51.66 16.42,51.66 R10.1
  Top 1.27: R10.1 14.04,51.95 13.12,51.03 10.84,51.03 R7.2
N$12
  Bottom 1.27: C17.+ 124.47,94.66 R13.2
  Bottom 1.778: R13.2 125,96.12 125,93 | 125,93 R12.2 | 125,93 125.09,93.09 137.31,93.09 137.31,92.81 141.16,88.97 144.36,88.97 IC3.1
N$13
  Top 0.813: IC5.6 IC5.7
N$14
  Top 0.813: IC6.7 IC6.6
N$15
  Top 1.27: C11.+ 34.98,53.19 42.78,53.19 43.74,54.15 R11.2
N$16
  Bottom 1.27: C22.1 40.53,33.29 IC1.21
N$17
  Top 0.813: R8.2 48.32,57.15 | 45.75,59.72 45.75,61.48 IC5.3
  Top 1.016: 48.32,57.15 45.75,59.72
  Top 1.27: C8.+ 50.12,57.15 R8.2
N$18
  Top 0.813: IC6.3 18,54.56 20.56,52 20.99,52 R9.2
  Top 1.27: C9.+ 25.25,54.59 22.78,52.12 21.11,52.12 R9.2
N$19  (via drill 0.6)
  Top 0.406: IC11.23 94.4,76.09 94.41,76.09
  Top 0.61: 94.41,76.09 91.94,78.56 v91.94,81.28
  Bottom 0.61: 91.94,84.38 Q1.1
  Bottom 0.813: C41.1 97.76,84.41
  Bottom 1.016: v91.94,81.28 91.94,84.38 | 97.76,84.41 Q1.1
N$20  (via drill 0.6)
  Top 0.406: IC11.24 93.6,75.4
  Top 0.61: 93.6,75.4 90.28,78.84 90.28,80.69 89.72,81.25 v88.59,81.25
  Bottom 0.61: 87.12,84.39 Q1.2
  Bottom 0.813: C42.1 82.8,82.02 | 85.31,84.41 Q1.2
  Bottom 1.016: v88.59,81.25 87.12,84.39 | 82.8,82.02 85.31,84.41
N$21
  Top 1.27: C10.+ 5.31,48.82 6.31,47.81 14.59,47.81 R10.2
N$22
  Bottom 1.27: C23.1 43.06,34.93 IC1.20 43.06,31.28 44.12,30.22 61.03,30.22 L4.1
N$23
  Bottom 1.27: IC1.3 27.82,23.63 24.56,20.38 24.56,15.23 CONNECTOR_PORTD.2
N$24  (via drill 0.6)
  Top 0.406: 99.31,70.62 99.31,69.9 IC11.17
  Top 0.61: 100.81,72.34 99.31,70.62
  Top 0.813: v108.75,72.56 108.75,72.34 108.31,71.91 103.84,71.91 103.81,71.88 102.94,72.34 100.81,72.34
  Top 1.27: MTC3.1 144.4,92.09 139.44,87.12 131.41,87.12 128.31,84.03 | 128.31,84.03 128.28,84 | 128.28,84 128.31,84 128.31,84.03 | 128.28,84 128.28,83.94 127.75,83.72 112.66,83.72 v109.47,83.66
  Bottom 0.813: v109.47,83.66 109.25,83.66
  Bottom 1.016: 109.25,83.66 108.31,82.72 108.31,73.84 108.75,73.41 v108.75,72.56
N$25  (via drill 0.6)
  Top 0.406: IC11.7 105.22,60.79
  Top 0.61: 105.22,60.79 110.25,59.81
  Top 0.813: 110.25,59.81 116.16,59.81 | 118,55.69 v118.06,55.62
  Top 1.016: 116.16,59.81 118,57.97 118,55.69 | v120.56,49.81 122.31,48.06 122.31,45.97 124.06,44.22 124.06,40.41
  Top 1.27: 124.06,40.41 125.78,39.22 v150.75,39.22
  Bottom 1.016: v118.06,55.62 117.91,54.97 117.88,54.91 117.88,51.03 118.47,49.81 v120.56,49.81
  Bottom 1.27: v150.75,39.22 153.5,35.94 153.5,17.25 154.72,16.03 MTC4.1
N$26
  pour Top: 61.03,99.41 76.78,99.41 76.78,83.19 61.03,83.19
N$27
  Bottom 1.27: CONNECTOR_PORTD.3 27.07,11.76 25.38,10.06 21.94,10.06 19.34,12.66 19.34,26.81 21.72,29.19 28.44,29.19 30.38,27.25 30.38,25.68 IC1.4
N$28
  Bottom 1.27: IC1.5 32.9,22.46 31.44,21 28.44,21 27.06,19.62 CONNECTOR_PORTD.4
N$29  (via drill 0.6)
  Top 1.27: v33.72,7.75 33.78,19.69 v35.44,21.53
  Bottom 1.27: CONNECTOR_PORTD.5 29.61,11.14 33,7.75 v33.72,7.75 | v35.44,21.53 IC1.6
N$30  (via drill 0.6)
  Top 1.27: v35.84,18.66 44.69,18.66 v48.16,21.97
  Bottom 1.27: CONNECTOR_PORTD.6 29.61,17.89 30.34,18.62 35.81,18.62 v35.84,18.66 | v48.16,21.97 IC1.11
N$31  (via drill 0.6)
  Top 1.27: v50.69,9.78 v50.72,21.97
  Bottom 1.27: CONNECTOR_PORTD.7 32.15,12.6 35,9.75 50.66,9.75 v50.69,9.78 | v50.72,21.97 50.69,23.34 IC1.12
N$32  (via drill 0.6)
  Top 1.27: v36.31,12.12 36.31,9.84 38.44,7.72 51.66,7.72 53.22,9.28 v53.22,21.97
  Bottom 1.27: CONNECTOR_PORTD.8 33.24,15.2 v36.31,12.12 | v53.22,21.97 IC1.13
N$33
  pour Top: 0.38,99.5 57.75,99.47 57.75,83.28 47.66,93.38 0.12,93.38 0.12,99.5
N$34  (via drill 0.6)
  Top 1.27: v69.34,13.59 69.34,17.62 R15.1
  Bottom 1.27: CONNECTOR_LIPO.4 70.4,12.54 v69.34,13.59
N$35
  Top 1.27: LED1.C 119.71,78.4 121.12,79.81 121.16,79.81 121.12,79.84 130.16,79.84 130.53,80.22 130.96,80.22 R18.1
N$36
  Top 1.27: LED2.C 128.18,76.76 R30.1
N$37  (via drill 0.6)
  Top 1.27: v140.53,61.84 138.4,63.72 C26.1
  Bottom 1.27: L2.1 140.59,61.78 v140.53,61.84 140.53,56.66 138.64,54.76 XBEE11-20.7
N$38
  Top 0.406: IC11.62 97.6,52.62 97.62,52.59 99.72,49.31
  Top 0.61: C45.2 100.06,47.16 99.72,47.81 99.72,49.31
N$39  (via drill 0.6)
  Top 1.27: v119.72,67.72 LED1.A
  Bottom 1.27: XBEE1-10.6 140.62,67.03 138.56,64.97 122.47,64.97 v119.72,67.72
N$40  (via drill 0.6)
  Top 0.406: IC11.61 96.81,52.22 98.47,48.84
  Top 0.813: 98.47,48.84 98.5,34.25
  Top 1.016: 98.5,34.25 96.03,31.78 88.12,31.78 86.06,29.72 v86.03,25.47 | v69.78,23.22 69.36,22.8 R15.2
  Top 1.27: R16.2 66.66,18.15 66.66,19.72 67.42,20.48 R15.2
  Bottom 0.813: v86.03,25.47 85.78,25.03
  Bottom 1.016: 85.78,25.03 72.56,25.03
  Bottom 1.27: 72.56,25.03 70.56,23.22 v69.78,23.22
N$41  (via drill 0.6)
  Top 1.27: LED2.A 124.33,68.45 v126.09,66.69
  Bottom 1.27: v126.09,66.69 137.19,66.69 138.69,68.19 138.69,70.78 XBEE1-10.7
N$42  (via drill 0.6)
  Top 0.406: IC11.64 99.31,53.75 | 103.84,51.03 103.84,50.94 103.41,50.51 C46.1
  Top 0.61: 99.31,53.75 103.84,51.03
  Top 1.27: v105.69,50.22 103.63,50.22 C46.1
  Bottom 1.016: 123.25,49.88 121.59,48.06 113.28,48.06 112.44,48.91 107,48.91 v105.69,50.22
  Bottom 1.27: L1.1 123.25,49.88
N$43
  Bottom 1.27: XBEE11-20.1 XBEE_IO.1
N$44  (via drill 0.6)
  Top 1.016: S3.2 119.66,89.92 v119.66,89.94
  Bottom 1.27: S3.1 S3.2 | 142.66,70.88 XBEE1-10.5 142.62,75.41 139.19,80 134.56,80 123.66,79.94 121.8,81.89 119.62,84.12 119.62,89.94 v119.66,89.94
N$45
  Bottom 1.27: XBEE11-20.2 148.64,46.55 148.09,46 XBEE_IO.2
N$46  (via drill 0.6)
  Top 1.27: v74.34,15.47 73.44,16.38 R28.1
  Bottom 1.27: CONNECTOR_LIPO.3 74.79,15.02 v74.34,15.47
N$47
  Bottom 1.27: XBEE11-20.3 146.64,47.05 145.62,46.03 145.62,43.44 XBEE_IO.3
N$48
  Bottom 1.27: XBEE11-20.4 144.64,47.67 143.03,46.06 143.03,43.38 XBEE_IO.4
N$49  (via drill 0.6)
  Top 0.406: IC11.14 102.89,66.39 102.91,66.41 105.13,68.3 v105.24,68.48
  Top 0.813: v105.24,68.48 105.22,68.39 105.13,68.3
  Top 1.27: LED3.A 57.74,65.92 61.03,62.75 v61.03,61.59
  Bottom 1.016: v61.03,61.59 61.03,57.69 65.88,52.56 72.06,52.56 74.75,54.88 80.62,54.88 92.84,66.41 99.41,66.41 103.26,66.41 v105.24,68.48
N$50
  Top 1.27: R33.1 LED3.C
N$51  (via drill 0.6)
  Top 0.406: IC11.35 83.8,66.39 83.69,66.5 81.28,68.06
  Top 0.813: 81.28,68.06 v78.5,69.88
  Bottom 0.813: EXT_HIGH.1
  Bottom 1.016: v78.5,69.88 73.19,69.88 72,68.69 EXT_HIGH.1
N$52  (via drill 0.6)
  Top 1.27: v77.28,15.41 77.41,15.53 R29.1
  Bottom 1.27: CONNECTOR_LIPO.2 77.28,12.59 v77.28,15.41
N$53  (via drill 0.6)
  Top 1.27: v128.94,18.75 128.94,22.78 R19.1 126.07,22.81 123.41,26.19 121.56,26.19 119.72,23.69 R24.2
  Bottom 1.27: S2.8 130.62,14.75 128.97,16.38 128.97,18.72 v128.94,18.75
N$54  (via drill 0.6)
  Top 1.27: R21.1 v136.56,18.91 138.59,16.88 142.22,16.88 142.94,17.6 R26.2
  Bottom 1.27: v136.56,18.91 136.56,18.84 136.12,18.41 S2.6
N$55  (via drill 0.6)
  Top 0.813: v111.94,18 111.65,17.98 IC9.9
  Top 1.27: C35.1 143.69,14.74 R26.1 143.68,12.29 143.72,12.25 129.25,12.25 v127.66,13.78
  Bottom 1.27: v127.66,13.78 123.47,18.03 v111.94,18
N$56  (via drill 0.6)
  Top 0.813: R27.1 148.69,14.2 148.69,13.38 | v112.78,21.78 v112.78,21.79 IC9.12
  Top 1.27: C36.1 148.63,14.01 R27.1 | 148.69,13.38 v146.41,13.38
  Bottom 1.27: v146.41,13.38 144.19,15.59 144.09,20.41 142.69,21.66 127.38,21.66 125.12,20.22 119.84,20.22 117.47,21.78 v112.78,21.78
N$57  (via drill 0.6)
  Top 1.27: R20.1 v132.72,18.81 130.81,17.09 127.91,17.09 126.86,17.76 R25.2
  Bottom 1.27: S2.7 133.59,17.72 v132.72,18.81
N$58
  Top 0.305: 103.28,24.84 IC9.1
  Top 1.27: C33.1 119.78,15.54 R24.1 119.78,16.89 119.78,13.91 116.72,13.97 115.66,15.38 115.66,22.72 112.31,27.91 105.84,27.94 103.28,25.75 103.28,24.84
N$59  (via drill 0.6)
  Top 0.813: 98,20.5 100.06,20.47 100.19,20.5 103.27,20.5 IC9.4
  Top 1.27: C34.1 R25.1 123.58,14.86 122.62,15.81 v122.62,24.5 | v96.56,24.44 96.56,21.94 98,20.5
  Bottom 1.27: v122.62,24.5 122.34,24.59 119.56,26.5 98.69,26.5 v96.56,24.44
N$60  (via drill 0.6)
  Top 1.27: v140.44,18.88 140.44,20.09 | 140.44,20.09 R22.1 | R27.2 147.59,18.16 145.69,20.06 140.47,20.06 140.44,20.09
  Bottom 1.27: S2.5 138.75,14.75 140.44,16.44 v140.44,18.88
N$61  (via drill 0.6)
  Top 1.27: v141.44,45.91 132.81,45.91 v130.12,48.56
  Bottom 1.27: XBEE_IO.5 140.48,44.95 v141.44,45.91 | v130.12,48.56 130.75,48.56 131.34,48.81 XBEE11-20.10
N$62  (via drill 0.6)
  Top 0.406: IC11.60 96,51.69 97.16,48.72
  Top 0.813: 97.16,48.72 97.12,35.19
  Top 1.016: 97.12,35.19 95.31,33.38 87.03,33.38 84.22,30.56 v84.22,23.03
  Top 1.27: R28.2 73.44,22.25 v74.75,23.03 | R31.2 85.94,21.53 v84.22,23.03
  Bottom 1.27: v74.75,23.03 v84.22,23.03
N$63
  Top 0.406: IC11.59 95.19,50.81 95.72,48.91
  Top 0.813: 95.72,48.91 95.66,35.88
  Top 1.016: 95.66,35.88 94.81,35.03 79.75,35.03
  Top 1.27: R32.2 80.96,20.64 R29.2 77.41,32.69 79.75,35.03
N$64  (via drill 0.6)
  Top 0.406: IC11.50 88,53.72 88,53.38 85.28,49.94
  Top 0.61: 85.28,49.94 85.25,49.72 85.28,43.28 85.72,42.75 v86.47,42.75
  Bottom 1.27: v86.47,42.75 EXT_LOW.2
N$65  (via drill 0.6)
  Top 0.406: IC11.49 87.2,53.77 87.09,53.66 v83.97,50.78
  Bottom 1.27: v83.97,50.78 EXT_LOW.3
N$66  (via drill 0.6)
  Top 0.406: IC11.48 85.11,55.99 85,55.88 v83.88,53.25
  Bottom 0.813: v83.88,53.25 75.12,53.25 72.97,50.75 | EXT_LOW.4
  Bottom 1.016: 83.97,43.19 81.09,39.62 71.94,39.59 68.91,42.06 68.88,49.28 72.97,50.75
  Bottom 1.27: 83.97,43.19 EXT_LOW.4
N$67  (via drill 0.6)
  Top 0.406: IC11.47 84.38,56.79 84.38,56.78 81.47,52
  Top 0.813: 81.47,52 v81.47,50.66
  Bottom 1.27: v81.47,50.66 EXT_LOW.5
N$68  (via drill 0.6)
  Top 0.406: IC11.46 83.94,57.59 80.31,52.97
  Top 0.813: 80.31,52.97 v80.31,51.81
  Bottom 0.813: v80.31,51.81 75.56,51.78 73.66,49.19 | 71.38,47.97 71.41,48.06 | 81.41,45.34 EXT_LOW.6
  Bottom 1.016: 81.41,43.72 79.59,41.34 72.97,41.41 71.38,42.75 71.41,48.06 73.66,49.19
  Bottom 1.27: 81.41,43.72 81.41,45.34
N$69  (via drill 0.6)
  Top 0.406: IC11.45 83.64,58.39 80.62,55.38
  Top 0.813: 80.62,55.38 78.88,53.62 v78.84,50.28
  Bottom 0.813: v78.84,50.28 78.82,50.02
  Bottom 1.27: 78.82,50.02 EXT_LOW.7
N$70  (via drill 0.6)
  Top 0.406: IC11.44 83.38,59.19 80.34,56.72
  Top 0.61: 78.12,55.94 78.06,55.88
  Top 0.813: 80.34,56.72 78.91,56.72 78.12,55.94 | 78.06,55.88 77.06,54.62 74.41,51.22 74.31,44.16 75.5,42.97 v76.59,42.97
  Bottom 0.813: EXT_LOW.8
  Bottom 1.27: v76.59,42.97 77.81,42.97 78.88,44.03 EXT_LOW.8
N$71  (via drill 0.6)
  Top 0.406: IC11.36 83.38,65.59 80.84,66.91
  Top 0.813: 80.84,66.91 v78.38,68.19
  Bottom 1.016: v78.38,68.19 75.16,68.22 EXT_HIGH.2
N$72  (via drill 0.6)
  Top 0.406: IC11.37 82.94,64.78 80.16,65.91
  Top 0.813: 80.16,65.91 76.94,67.28 76.94,68.34 75.75,69.53 70.56,69.53 69.84,68.81 69.84,65.94 v69.78,65.88
  Bottom 1.016: v69.78,65.88 71.01,64.65 EXT_HIGH.3
N$73  (via drill 0.6)
  Top 0.406: IC11.38 85.36,64.03 82.59,64.03 79.5,64.75
  Top 0.813: 79.5,64.75 v77.22,64.75
  Bottom 1.016: v77.22,64.75 EXT_HIGH.4
N$74  (via drill 0.6)
  Top 0.406: IC11.39 82.12,63.19 79.75,63.44
  Top 0.61: 75.72,63.44 70.12,63.44 v69.5,62.81
  Top 0.813: 79.75,63.44 75.72,63.44
  Bottom 0.61: 69.5,62.06 69.81,61.75 | 71.65,61.75 EXT_HIGH.5
  Bottom 1.016: v69.5,62.81 69.5,62.06 | 69.81,61.75 71.65,61.75
N$75  (via drill 0.6)
  Top 0.406: IC11.40 82.09,62.41 80.09,62.12
  Top 0.813: 80.09,62.12 v77.34,62.12
  Bottom 1.016: v77.34,62.12 EXT_HIGH.6
N$76  (via drill 0.6)
  Top 0.406: IC11.41 82.5,61.59 79.88,60.91
  Top 0.61: 75.81,60.81 70.53,60.84 69.91,60.84 69.59,60.53 v69.59,60.19
  Top 0.813: 79.88,60.91 75.81,60.81
  Bottom 0.61: 71.44,59.16 71.85,59.57 EXT_HIGH.7
  Bottom 1.016: v69.59,60.19 70.62,59.16 71.44,59.16
N$77  (via drill 0.6)
  Top 0.406: IC11.42 82.81,60.78 80.12,59.56
  Top 0.813: 80.12,59.56 v77.31,59.56
  Bottom 1.016: v77.31,59.56 EXT_HIGH.8
N$78  (via drill 0.6)
  Top 0.406: 101.56,76.53 101.25,76.53 | 99.78,72.88 98.44,71 IC11.18
  Top 0.61: 101.25,76.53 99.81,75.09 99.78,72.88
  Top 0.813: v114.28,76.56 101.59,76.56 101.56,76.53
  Bottom 1.016: 122.22,77.84 122.19,77.88
  Bottom 1.27: XBEE1-10.9 134.62,72.87 136.91,75.16 136.91,77.03 136.09,77.84 122.22,77.84 | 122.19,77.88 115.22,77.88 v114.28,76.56
N$79  (via drill 0.6)  (1 unrouted)
  Top 0.406: IC11.19 97.59,71.53
  Top 0.61: 97.59,71.53 v98.19,72.56
  Bottom 1.27: XBEE11-20.8 136.64,48.26 134.41,46.03 126.62,46.03 124.81,44.22 121.69,44.22 v119.72,45.75
N$80  (via drill 0.6)
  Top 1.27: v144.56,73.5 130.47,73.5 128.06,71.06 128.09,43.69 130.34,41.16 137.91,41.16 v137.94,41.19
  Bottom 1.27: XBEE1-10.4 144.62,73.44 v144.56,73.5 | v137.94,41.19 XBEE_IO.6
N$81
  Bottom 1.27: XBEE_IO.7 135.4,44.28 137.12,46.09 138.97,46.09 140.62,47.66 140.62,48.83 XBEE11-20.6
N$82  (via drill 0.6)
  Top 1.016: v142.31,65.25 144.03,66.31 R35.2 145.6,68.32 v145.69,68.41 | v120.09,64.88 112.62,64.88 111.56,65.75 v111.22,66.06 | v110.62,72.59 110.62,73.97 110.12,74.66 109.97,74.66 R34.1
  Bottom 0.61: v111.22,66.06 111.19,69.84
  Bottom 0.813: 110.62,71.41 110.59,71.38
  Bottom 1.016: v142.31,65.25 141.53,65.25 139.03,62.75 122.22,62.75 v120.09,64.88 | 111.19,69.84 110.59,71.38 | v110.62,72.59 110.62,71.41
  Bottom 1.27: v145.69,68.41 146.62,69.34 XBEE1-10.3
N$83  (via drill 0.6)
  Top 0.406: IC11.57 93.69,54.1 93.69,51.56
  Top 0.61: 93.69,51.56 v94.16,49.34
  Bottom 0.813: v94.16,49.34 94.16,48.38 | 98.59,43.94 109.69,43.94 | 112.19,37.37 JTAG.1
  Bottom 1.016: 94.16,48.38 98.59,43.94 | 109.69,43.94 112.19,41.44 112.19,37.37
N$84  (via drill 0.6)
  Top 1.27: R37.1 144.73,52.44 v142.59,52.44 142.43,52.6 R36.2
  Bottom 1.27: XBEE11-20.5 142.64,52.39 v142.59,52.44
N$85  (via drill 0.6)
  Top 0.406: IC11.55 92,51.57 92,51.56 92.09,47.09
  Top 0.61: 92.09,47.09 92.56,46.12
  Top 0.813: 92.56,46.12 v92.47,42.47
  Bottom 0.813: v92.47,42.47 107.91,42.5
  Bottom 1.016: 107.91,42.5 109.62,40.79 JTAG.3
N$86  (via drill 0.6)
  Top 0.406: IC11.56 92.8,51.7 92.81,51.69 93.03,48.12
  Top 0.61: 93.03,48.12 94.22,46.94 94.22,46.91
  Top 0.813: 94.22,46.91 v94.22,40.88
  Bottom 0.813: v94.22,40.88 94.41,40.84 105.66,40.84
  Bottom 1.016: 105.66,40.84 107.08,39.42 JTAG.5
N$87
  Top 1.27: R40.1 61.29,51.4 63.03,49.66 LED6.C
N$88  (via drill 0.6)
  Top 0.406: IC11.54 91.2,51.95 91.22,51.94 91.06,46.66
  Top 0.61: 91.06,40.94 91.06,46.66
  Top 1.016: v92.47,39.06 91.06,40.94
  Bottom 0.813: 93.75,37.37 v92.47,39.06
  Bottom 1.016: JTAG.9 93.75,37.37
N$89
  Top 1.016: LED4.C 62.99,57.76 R38.1
N$90
  Top 1.27: R39.1 LED5.C
N$91  (via drill 0.6)  (1 unrouted)
  Top 0.406: IC11.5 103.28,59.19 107.12,58.34
  Top 0.813: 107.12,58.34 113.25,58.34 | v64.56,51.03 LED4.A
  Top 1.016: 113.25,58.34 v115.53,56.97
N$92  (via drill 0.6)  (1 unrouted)
  Top 0.406: v105.66,59.72 104.5,59.97 IC11.6
  Top 1.27: LED5.A 62.59,64.28 63.59,63.06 v63.59,61.62 63.62,62.06
N$93
  Top 0.813: 57.53,34.12 57.69,34.12 | 63.03,40.68
  Top 1.016: 57.53,34.12 IC1.15 | 57.69,34.12 62.97,39.41 63.03,40.68
  Top 1.27: LED6.A 63.03,40.68 | IC1.15
N$94
  pour Top: 6.28,89.81 6.28,83.34 51.91,83.34 51.91,83.5 45.75,89.66 7.06,89.81 6.78,89.84
N$95
  pour Top: 8.75,79.53 52.47,79.53 52.53,79.47 52.88,79.47 52.88,70.12 52.41,70.12 48.75,73.78 12.62,73.78 12.22,74.19 12.22,74.22 7,79.44 7.09,79.44 7.16,79.5 8.72,79.5
N$96
  pour Top: 18.41,21.53 31.88,21.53 31.88,16.78 23.09,16.78 23.09,10.97 31.56,10.97 31.56,4.22 18.41,4.22
N$97
  pour Top: 13,22.81 13.03,22.75 13.03,14.97 4.16,15.03 0.47,12.56 0.34,12.59 0.34,35.66 1.84,34.25 2.12,33.97 2.12,22.72 4,20.81 10.72,20.81 10.72,24.91 10.69,24.94 13.09,24.94 13.12,23.25
N$98
  pour Top: 32.47,51.06 32.47,39.69 33.47,38.69 33.47,36.81 34.88,35.41 24.44,35.41 24.44,47.06 24.78,47.41 26,47.41 26.97,48.38 28.47,48.38 31.22,51.12 32.41,51.12
N$99
  pour Top: 30.94,45.66 30.94,41.84 30.41,41.31 29.12,41.31 28.25,42.19 28.25,46.69 28.16,46.78 28.72,47.34 30.25,47.34 30.91,46.69 30.91,45.75 30.94,45.72
N$100
  pour Top: 36.66,16.75 46,16.75 48.75,19.5 48.75,9.66 48.78,9.62 39.62,9.62 38.5,10.75 38.5,13.03 38.34,13.19 38.06,13.19 37.78,13.47 37.34,13.47 36,14.81 36,16.12 36.62,16.75
N$101
  pour Top: 33.72,5.88 52.53,5.84 53.94,7.25 53.94,4.09 33.62,4.09 33.62,5.88
N$102
  pour Top: 55.44,21.5 55.44,16.72 58.66,16.72 59.19,17.25 63.19,17.25 64.09,18.16 64.09,18.41 63.66,18.84 62.44,18.84 61.31,19.97 61.31,21.84 55.78,21.84
N$103
  pour Top: 60.25,11.88 60.19,11.59 60.22,5.75 100.75,5.75 100.75,11.91 101.97,13.12 101.97,14.81 100.59,16.19 95.47,16.19 87.25,7.97 67.06,7.97 65.75,9.28 65.75,11.03 67.16,12.44 67.16,15.34 67.09,15.34 64,12.25 60.59,12.25 60.22,11.88
N$104
  pour Top: 94.5,30.25 94.5,20.22 94.53,20.19 93.75,20.19 88.34,14.78 88.34,22.31 87.88,23.16 87.88,28.62 89.16,30.22 93.66,30.22 93.69,30.25
N$105
  pour Top: 79.34,31.47 79.34,22.84 79.72,22.47 81.81,22.47 82.47,21.81 82.47,31.5 84.25,33.28 84.25,33.47 81.34,33.47
N$106
  pour Top: 69.66,52.47 69.66,40.38 72.59,37.44 75,37.44 75.66,36.78 86.47,36.78 88.34,38.66 89.75,38.66 90.03,38.94 90.03,39.41 89.81,39.62 78.88,39.62 77.34,41.16 75.09,41.16 72.44,43.81 72.44,45.25 71.53,46.16 71.25,46.44 71.25,52.47
N$107
  pour Top: 69.97,79.69 70.03,79.66 64.75,74.38 64.75,78.84 64.44,79.16 60.09,79.16 60.03,79.22 60.03,79.72 69.94,79.72
N$108
  pour Top: 87.72,67.84 95.38,67.84 95.38,58.72 95.38,58.66 96.19,57.84 90.66,57.84 88.84,56.03 87.72,56.03
N$109
  pour Top: 112.19,49.56 112.19,43.78 105.44,43.78 102.97,41.31 102.06,41.31 102.06,41.75 105.06,44.75 105.06,45.47 105.16,45.38 109.22,45.34 110.91,49.56
N$110
  pour Top: 102.66,86.38 102.66,83.06 107.53,83.06 107.53,84.28 107.53,84.38 108.69,85.53 108.69,86.38
N$111
  pour Top: 113.03,53.56 111.44,55.56 109.75,55.56 109.75,54.72 109.12,53.88 107.12,53.88 105.03,54.94 104.72,54.66 104.72,54.12 105.84,53.16 105.84,51.78 106.06,51.56 106.69,51.56 107.25,51 107.25,50.16 108.19,52.16 110.03,53.44 113.09,53.44
N$112
  pour Top: 129.97,58.53 129.97,51.06 130.66,51.06 134.53,51.06 134.53,51.28 134.22,51.59 133.78,51.59 132.88,52.5 132.88,53.59 133.81,54.53 134.75,55.47 134.75,56.53 135.72,57.5 136.34,57.5 136.59,57.75 136.59,58.53
N$113
  pour Top: 111.22,6.28 117.75,6.28 117.75,12 111.22,12
N$114
  pour Top: 123.78,35.69 133.47,35.69 133.47,29.59 130.69,29.59 127.47,34 127.34,34.16 123.78,34.16
N$115
  pour Top: 145.16,33.88 148.22,33.88 148.59,33.5 148.59,28.81 149.72,27.69 151.16,27.69 151.16,21.12 145.41,26.66 145.28,26.78
N$116
  pour Top: 134.06,69.44 143.69,69.44 143.69,68.28 140.84,66.59 140.84,64.09 139.22,65.62 135.5,65.62 134.12,66.59
N$117
  pour Top: 129.69,70.03 129.69,61.69 133.31,61.69 133.31,62.62 130.88,64.34 130.88,70.03
N$118
  pour Top: 155.97,75.75 159.69,75.69 159.69,0.25 151.22,0.25 151.22,0.81 156.5,5.47 156.5,75.66 155.97,75.69
N$119
  pour Top: 146.81,89.12 146.88,89.03 146.88,83.03 148.28,84.44 150.94,84.44 153.09,82.28 159.75,82.28 159.81,82.34 159.81,99.53 155.19,99.53 155.19,94.03 155.38,94.03 156.38,93.03 156.38,89.31 155.25,88.19 148.69,88.19 147.72,89.16 146.81,89.16
N$120
  pour Top: 146.91,69.47 151.31,69.47 151.31,63.16 149.59,63.16 149.59,63.19 149.59,64.38 150.5,64.38 150.5,67.84 150.5,68.06 146.91,68.06
N$121
  pour Top: 127.03,99.41 127.03,95.59 135.69,95.59 138.47,98.38 140.53,98.38 141.81,99.66 127.28,99.66
N$122
  pour Top: 109.56,69.38 112.41,69.38 113,68.78 113,66.97 113.03,66.94 112.56,66.94 112.03,67.47 109.91,67.47 109.34,68.03 109.34,69.16
N$123
  pour Top: 113.22,37.69 113.22,32.19 116.12,32.19 116.12,33.16 116.12,33.66 117.69,35.22 117.69,35.75 117.16,35.75 114.91,38 113.22,38
N$124
  pour Bottom: 0.5,99.38 52.09,99.38 52.09,77.03 56.22,71.25 56.22,54.41 55.34,53.53 48.5,53.53 47.53,54.5 45.12,54.5 44.62,55 44.62,59.41 40.94,63.09 39.16,63.09 33.62,68.62 26.19,68.62 25,69.81 7.91,86.91 7.91,92.91 6.34,94.47 0.5,94.47
N$125
  pour Bottom: 14.62,72.56 14.62,57.69 19.72,51.25 26.91,51.25 26.91,60.53 24.28,60.53 23.19,61.62 23.19,64
N$126
  pour Bottom: 7.41,73.56 7.5,65.03 4.56,62.09 4.56,59.84 6.41,58 6.41,56.94 9.62,53.72 10.22,53.72 10.25,53.69 10.34,53.69 10.34,74.06 7.5,74.06 7.41,73.72
N$127
  pour Bottom: 15.16,50.09 22.28,40.84 19.75,40.84 17.38,38.47 15.19,38.47 15.06,50.03
N$128
  pour Bottom: 0.19,57.91 0.09,57.91 0.09,42.69 1.06,42.69 1.41,43.03 1.41,43.06 1.69,43.34 4.09,43.34 5.06,42.38 5.38,42.06 5.38,28.38 6.66,27.09 7.53,27.09 7.53,42.25 5.69,44.84 5.69,50.62 1.84,54.59 1.84,56.25
N$129
  pour Bottom: 0.28,23.19 0.22,23.16 0.16,0.16 22.25,0.16 22.25,0.28 22.31,0.28 22.31,2.56 21.44,2.56 20.53,3.47 7.22,3.47 6.12,4.56 6.12,19.53 2.44,23.22 0.31,23.22
N$130
  pour Bottom: 14.94,11.72 17.28,11.72 17.28,33.22 14.94,33.22
N$131
  pour Bottom: 11.94,30.41 11.94,27.34 14.84,24.25 14.84,30.41
N$132
  pour Bottom: 42.84,23.38 46.16,23.38 46.16,20.97 46.81,20.31 54.5,20.31 55.81,21.62 55.81,22.72 56.59,23.5 57.72,23.5 57.72,28.16 59.62,28.16 60.5,27.28 60.5,17.06 58.16,14.72 57.72,14.72 56.19,16.25 44.94,16.25 44.94,18.81 44.94,19.28 42.75,21.47 42.75,23.28
N$133
  pour Bottom: 64.34,49.31 64.84,49.31 66.41,50.88 66.97,50.88 67.34,50.5 67.34,42.69 66.88,42.22 60.81,42.22 58.34,39.75 52.56,39.75 52.56,41.28 53.97,42.69 55.38,42.69 55.69,42.38 57.41,42.38
N$134
  pour Bottom: 21.19,35.69 27.88,35.69 27.88,36.72 27.84,36.72 27.62,36.94 21.81,36.94 21.19,36.31
N$135
  pour Bottom: 82.81,9.75 102,9.75 102,11.59 103.16,12.75 105.75,12.75 106.91,11.59 106.91,9.81 109.41,9.81 109.41,14.16 108.81,14.16 105.66,14.16 99.47,20.34 94.28,20.34 89.44,25.19 88.62,25.19 87.16,23.72 87.16,23.34 84.88,21.06 70.22,21.06 68.59,19.44 68.59,15.66 68.62,15.62 71.47,15.62 73,17.16 73.38,17.53 78.56,17.53 80.22,15.88 82.94,15.88 84.75,14.06 84.75,12.62 82.75,10.62 82.75,9.81
N$136
  pour Bottom: 159.56,8.03 159.56,0.06 22.56,0.06 22.56,2.53 53.5,2.53 53.53,2.53 55.38,4.38 153.34,4.38 156.41,7.44 157.62,7.44 159.56,9.38
N$137
  pour Bottom: 80.91,68.16 90.84,68.16 90.84,67.03 79.97,56.81 76.97,56.81 76.97,57.97 78.06,57.97 79.06,58.97 79.06,66.31
N$138
  pour Bottom: 66.31,95.56 77.09,95.56 77.09,94.16 77.03,94.16 74.41,91.53 74.41,87.72 76.78,85.34 79.88,85.34 79.88,82.25 77.66,84.47 73.75,84.47 69.72,88.5 69.72,92.12
N$139
  pour Bottom: 30.12,30.91 36.03,30.91 38.31,28.62 38.31,28.03 32.97,28.03
N$140
  pour Bottom: 94.66,81.66 100.47,81.66 100.47,76.53 100.47,76.34 90.5,76.34 90.5,79.88 92.88,79.88
N$141
  pour Bottom: 100.12,90.94 100.09,87.81 100.06,87.78 85.66,87.78 85.66,90.56 84.78,91.44 82.75,91.44 82.75,93 96.06,93 98.12,90.94
N$142
  pour Bottom: 127.72,90.88 135.91,90.88 139,87.78 139,87.5 137.66,86.16 137.66,83.41 136.12,81.88 124.72,81.88 121.53,85.06 121.53,87.22 122.97,87.22 122.97,85.19 122.97,84.94 124.97,82.94 126.06,82.94 126.84,83.72 126.84,83.75 127.09,84 127.09,90.88 127.69,90.88
N$143
  pour Bottom: 94.97,62.12 106.72,63.12 108.25,63.94 108.25,63.12 105.91,61.06 104.94,61.06 103.81,59.94 103.81,59.03 104.75,58.09 104.75,56.81 95.75,56.81 91.47,52.31 91.47,58.62
N$144
  pour Bottom: 102.34,53.84 97.75,53.84 95.03,51.12 95.03,50.97 95.72,50.28 95.72,49.25 99.47,45.5 104.97,45.5 104.97,45.53 102.41,48.09 102.41,53.78
N$145
  pour Bottom: 92.44,47.78 92.44,43.97 96.41,43.97
N$146
  pour Bottom: 87.94,59.03 83.72,54.94 83.72,54.75 83.88,54.59 84.66,54.59 85.34,53.91 85.34,52.5 87.81,52.5 87.88,52.56 87.94,52.62
N$147
  pour Bottom: 60.66,68.12 60.69,68.12 60.69,63.22 63.62,63.22 63.62,71.06
N$148
  pour Bottom: 59.69,81.47 59.69,77.06 60.34,77.06 64.12,77.06
N$149
  pour Bottom: 71.69,71.38 76.53,71.38 75.25,72.66 71.69,72.66
N$150
  pour Bottom: 82.72,73.03 88.81,73.03 87.41,74.44 86.62,74.44 85.75,74.44 85.25,74.94 79.84,74.94 82.16,73.03
N$151
  pour Bottom: 90.53,32.19 104.34,32.19 104.34,32.69 100.28,32.69 97.91,35.06 97.91,35.84 96.53,35.84 92.84,35.84 92.84,34.5
N$152
  pour Bottom: 108.44,57.84 110.75,60.66 110.97,60.66 111.47,60.16 111.47,59.88 111.72,59.62 113.44,59.62 114.22,60.41 114.25,60.41 115.69,58.91 115.06,58.28 114.62,58.16 113.81,57.34 113.81,56.66 114.88,55.59 116.44,55.59 116.31,52.53 111.12,56.97 108.44,56.97
N$153
  pour Bottom: 118.31,35.5 124.44,35.47 125.75,36.78 125.75,38.19 124.72,39.22 118.06,39.22 118.06,43.34 115.12,46.47 116.78,46.44 120.69,42.66 123.69,42.62 124.31,42 124.31,41.22 125.16,40.38 128.56,38.5 128.56,34.5 125.62,32.44 119.31,32.44 119.31,33.19 118.22,34.28 118.22,35.47 118.34,35.47
N$154
  pour Bottom: 53.12,9.47 65.38,9.47 64,10.84 64,14.72 59.66,10.38 53.16,10.38 53.12,10.38
N$155
  pour Bottom: 130.81,76.12 116.59,76.12 115.59,75.12 115.59,74.84 117.09,73.34 117.09,71.5 118,71.5 119,70.5 119,69.88 119.34,69.53 120.84,69.53 123.09,67.28 123.97,67.28 125.22,68.53 130.41,68.5 130.53,68.5
N$156
  pour Bottom: 151.56,99.75 159.81,99.75 159.81,82.53 157.25,85.09 157.25,94.06 153.19,98.12 151.56,98.12
N$157
  pour Bottom: 155.22,57.44 155.22,78.78 154.28,79.72 153.94,79.72 151.59,77.38 151.59,76.78 152.59,75.78 152.84,75.53 152.84,60.84 151.84,59.84 149,59.84 149,57.41 155.19,57.41 155.19,57.47
N$158
  pour Bottom: 155.31,53.44 155.34,53.44 155.34,42.97 152.81,42.97 152.81,50.81 144.66,50.81 144.66,53.5 143.88,54.28 141.75,54.28 142.78,55.31 142.78,58.22 145.44,58.22 145.44,54.75 146.44,53.75 147.75,53.75 148.56,54.56 148.97,54.56 150.09,53.44 155.25,53.47
N$159
  pour Bottom: 85.88,99.91 97.28,99.91 94,96.62 93.38,96.62 85.94,96.62 85.62,96.94 85.62,99.78 85.75,99.91
N$160
  pour Bottom: 116.31,14.03 116.31,9.59 117.53,9.66 149.88,9.69 151.56,11.47 151.56,23.06 146.72,23.06 145.62,23.91 143.38,23.88 143.38,23.41 146.19,21.03 146.19,15.94 148.09,14.03 148.09,12.69 147.16,11.75 144.56,11.75 143.81,12.31 129.12,12.31 128.47,11.84 126.56,11.84 122.59,15.81 120.09,15.81 118.34,14.06 116.34,14.06
N$161
  pour Bottom: 27.19,67.06 27.19,62.28 27.78,62.28 29.03,63.53 29.31,63.81 29.31,67.06
N$162
  pour Bottom: 114.75,79.66 121.22,79.66 120.56,80.31 117.09,80.31 112.84,84.56 112.84,83.75 112.84,83.5 114.31,82.03 114.31,79.66
N$163
  pour Bottom: 114.56,88.22 117.75,85.09 117.72,87.34 116.28,87.34 115.41,88.22
N$164
  pour Bottom: 83.28,79.38 87.03,79.38 87.03,80.84 86.19,82.62 85.88,82.62 82.88,79.38
N$165
  pour Bottom: 148.28,39.41 151.72,35.41 151.72,34.47 149.5,34.47 148.31,33.28 148.31,36.31 145.78,38.84 143.84,38.84 142.84,37.84 142.84,36.44 144.03,35.25 140.75,35.25 140.75,37.69 142.56,39.44
N$166
  pour Bottom: 130.53,44.22 127.5,44.22 126.81,43.47 132,40.38 132,35.34 134.47,37.09 137.38,37.09 137.38,37.66 135.44,37.66 131.22,41.88 131.22,41.91 130.53,42.59
N$167
  pour Bottom: 99.81,24.78 109.72,24.78 109.72,24.75 109.72,24.47 107.97,22.72 107.97,20 109.03,17.72 107.41,17.72 101.53,23.59 98.38,23.59
N$168
  pour Bottom: 76.91,36.16 83.22,36.16 83.22,36.06 82.34,35.19 76.12,35.19 76.09,35.22 76.09,35.34
N$169
  pour Bottom: 40.09,50.91 44.19,55.09 44.91,55.34 45.75,54.5 39.81,48.62 39.81,50.62
N$170
  pour Bottom: 54.97,49.38 54.97,49.22 48.44,42.69 45.56,42.69 52.81,49.34
N$171
  pour Bottom: 73.91,38.03 72.53,36.31 67.56,41 66.62,41.94 66.66,41.97 71.66,37.72
N$172
  pour Bottom: 155.59,39.72 155.59,17.81 155.12,18.28 155.16,37 153,39.53 153,39.66 153.06,39.72
N$173
  pour Bottom: 24.47,7.59 30.44,7.59 28.34,9.69 27.91,9.69 26.47,8.25 23.91,8.25
N$174
  pour Bottom: 137.69,73 140.66,73 140.66,74.59 138.97,76.88 138.84,76.88 138.84,74.16
OP_REF  (via drill 0.6)
  Top 0.61: IC2.1 47.31,44.41
  Top 0.813: IC2.1 IC2.2
  Top 1.016: 47.31,44.41 43.34,40.44 43.34,37.59 41.88,36.12 38.69,36.12
  Top 1.27: R3.2 22.19,44.97 21.09,46.06 R9.1 24.09,49.25 | C27.2 25.59,50.75 24.09,49.25 | R8.1 48.43,54.31 v46.16,52.03 | 24.09,49.25 v24.03,49.31 | 38.69,36.12 37.84,36.97 37.84,41.44 v37.38,41.91
  Bottom 1.27: v46.16,52.03 46.16,51.97 39.66,45.41 37.78,45.41 35.92,43.48 | 35.92,43.48 35.16,42.69 31.47,42.62 29.66,42.66 | v24.03,49.31 24.03,49.03 29.66,42.66 | 29.66,42.66 29.53,42.78 C16.+ | v37.38,41.91 37.38,42.02 35.92,43.48
RST  (via drill 0.6)
  Top 0.813: IC9.13 111.12,23.05 v111.09,23.12 | 105.47,24.69 105.47,23.66 104.88,23.06 | 104.88,23.06 103.29,23.06 IC9.2 101.98,23.05 | 104.88,23.06 105.44,22.5 105.44,19.78 104.91,19.25 IC9.5 | IC9.10 v110.71,19.25 v110.72,19.25 | 100.47,28.43 R23.2